# EAGLE design DAC and Digipot Breakout Board (EAGLE 9.6.2)
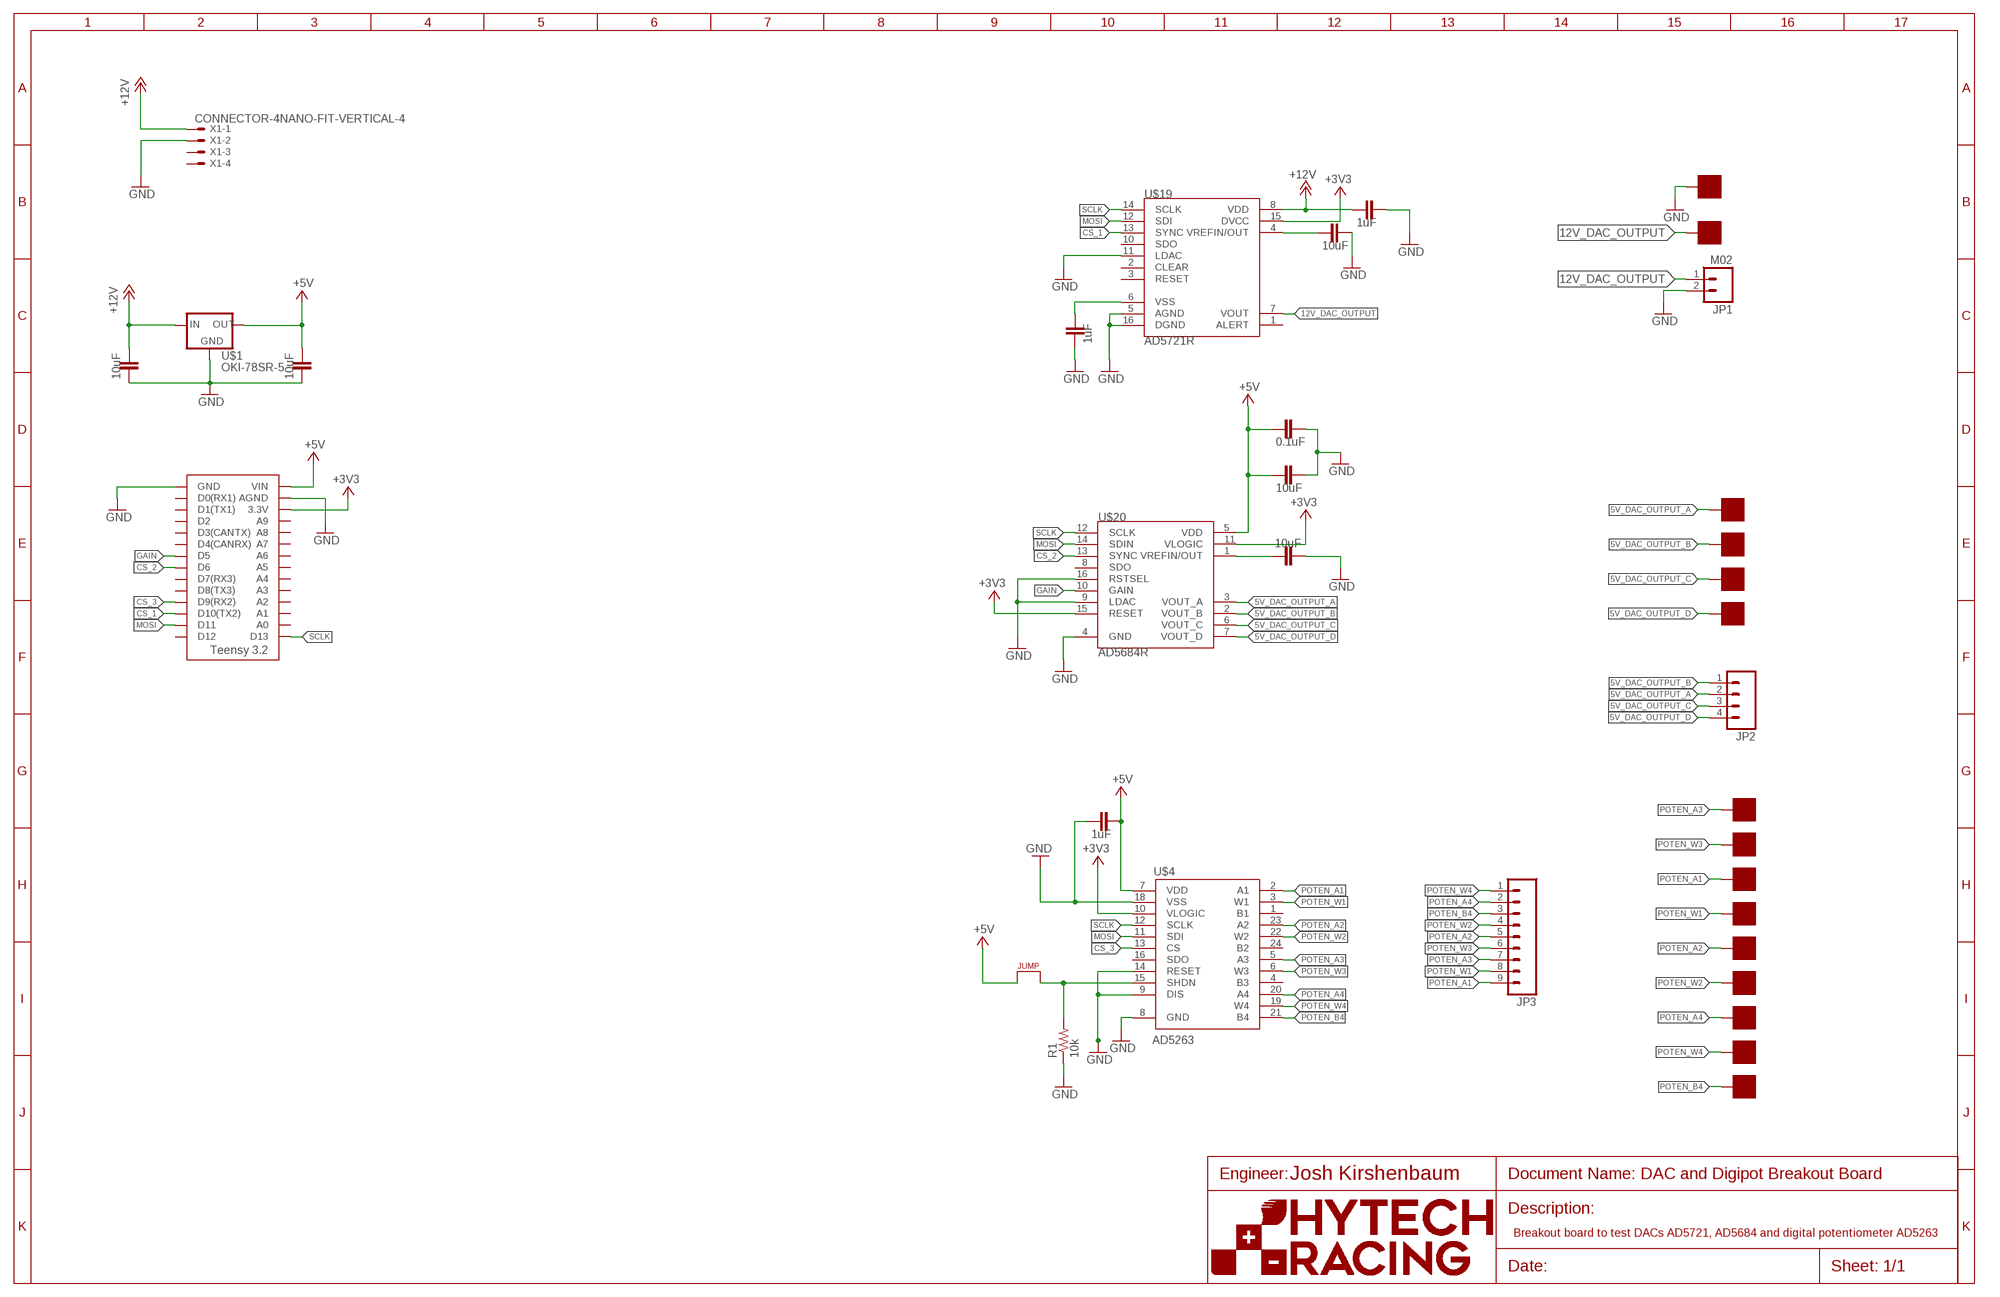
[diagram p0: schematic, sheet 1]
U$3 (FRAME_B): FRAME_DESCRIPTION: Default; ORIENTATION: LANDSCAPE; SIZE: B

## Parts
C1  1uF  CAP0603-CAP  [0603-CAP]
C2  1uF  CAP0603-CAP  [0603-CAP]
C3  10uF  CAP0603-CAP  [0603-CAP]
C4  0.1uF  CAP0603-CAP  [0603-CAP]
C5  1uF  CAP0603-CAP  [0603-CAP]
C6  10uF  CAP0603-CAP  [0603-CAP]
C7  10uF  CAP0603-CAP  [0603-CAP]
C8  10uF  CAP0603-CAP  [0603-CAP]
C9  10uF  CAP0603-CAP  [0603-CAP]
J1  JUMPER.1  [1X02]
JP1  M02  [1X02]
JP2  M04  [1X04]
JP3  M09  [1X09]
R1  10k  RESISTOR0603  [0603-RES]
U$1  OKI-78SR-5  [OKI-78SR]
U$2  TEENSY_3.2_SIMPLE  [TEENSY_3.2_SIMPLE]
U$4  AD5263  [TSSOP-24]
U$5  SOLDER_PAD  [SOLDER_PAD_XSMALL]
U$6  SOLDER_PAD  [SOLDER_PAD_XSMALL]
U$7  SOLDER_PAD  [SOLDER_PAD_XSMALL]
U$8  SOLDER_PAD  [SOLDER_PAD_XSMALL]
U$9  SOLDER_PAD  [SOLDER_PAD_XSMALL]
U$10  SOLDER_PAD  [SOLDER_PAD_XSMALL]
U$11  SOLDER_PAD  [SOLDER_PAD_XSMALL]
U$12  SOLDER_PAD  [SOLDER_PAD_XSMALL]
U$13  SOLDER_PAD  [SOLDER_PAD_XSMALL]
U$14  SOLDER_PAD  [SOLDER_PAD_XSMALL]
U$15  SOLDER_PAD  [SOLDER_PAD_XSMALL]
U$16  SOLDER_PAD  [SOLDER_PAD_XSMALL]
U$17  SOLDER_PAD  [SOLDER_PAD_XSMALL]
U$18  SOLDER_PAD  [SOLDER_PAD_XSMALL]
U$19  AD5721R  [TSSOP-16]
U$20  AD5684R  [TSSOP-16]
U$21  SOLDER_PAD  [SOLDER_PAD_XSMALL]
X1  CONNECTOR-4NANO-FIT-VERTICAL-4  [NANO-FIT_VERTICAL-4]

## Nets
5V_DAC_OUTPUT_A: JP2.2 U$6.P$1 U$20.3(VOUT_A)
5V_DAC_OUTPUT_B: JP2.1 U$7.P$1 U$20.2(VOUT_B)
5V_DAC_OUTPUT_C: JP2.3 U$8.P$1 U$20.6(VOUT_C)
5V_DAC_OUTPUT_D: JP2.4 U$9.P$1 U$20.7(VOUT_D)
12V_DAC_OUTPUT: JP1.1 U$5.P$1 U$19.7(VOUT)
+3V3: U$2.3.3V U$4.10(VLOGIC) U$19.15(DVCC) U$20.11(VLOGIC) U$20.15(RESET)
+5V: C3.2 C4.2 C5.1 C9.2 J1.1 U$1.3(OUT) U$2.VIN U$4.7(VDD) U$20.5(VDD)
+12V: C2.2 C8.2 U$1.1(IN) U$19.8(VDD) X1.P$1
CS_1: U$2.D10(TX2) U$19.13(SYNC)
CS_2: U$2.D6 U$20.13(SYNC)
CS_3: U$2.D9(RX2) U$4.13(CS)
GAIN: U$2.D5 U$20.10(GAIN)
GND: C1.2 C2.1 C3.1 C4.1 C5.2 C6.1 C7.2 C8.1 C9.1 JP1.2 R1.1 U$1.2(GND) U$2.GND U$4.8(GND) U$4.9(DIS) U$4.14(RESET) U$4.18(VSS) U$19.5(AGND) U$19.11(LDAC) U$19.16(DGND) U$20.4(GND) U$20.9(LDAC) U$20.16(RSTSEL) U$21.P$1 X1.P$2
MOSI: U$2.D11 U$4.11(SDI) U$19.12(SDI) U$20.14(SDIN)
N$1: U$2.AGND ; supply symbol labelled GND
N$2: J1.2 R1.2 U$4.15(SHDN)
N$3: C6.2 U$19.4(VREFIN/OUT)
N$4: C7.1 U$20.1(VREFIN/OUT)
POTEN_A1: JP3.9 U$4.2(A1) U$10.P$1
POTEN_A2: JP3.5 U$4.23(A2) U$12.P$1
POTEN_A3: JP3.7 U$4.5(A3) U$14.P$1
POTEN_A4: JP3.2 U$4.20(A4) U$16.P$1
POTEN_B4: JP3.3 U$4.21(B4) U$18.P$1
POTEN_W1: JP3.8 U$4.3(W1) U$11.P$1
POTEN_W2: JP3.4 U$4.22(W2) U$13.P$1
POTEN_W3: JP3.6 U$4.6(W3) U$15.P$1
POTEN_W4: JP3.1 U$4.19(W4) U$17.P$1
SCLK: U$2.D13 U$4.12(SCLK) U$19.14(SCLK) U$20.12(SCLK)
VSS: C1.1 U$19.6(VSS)
Unconnected: U$2.A0 U$2.A1 U$2.A2 U$2.A3 U$2.A4 U$2.A5 U$2.A6 U$2.A7 U$2.A8 U$2.A9 U$2.D0(RX1) U$2.D1(TX1) U$2.D2 U$2.D3(CANTX) U$2.D4(CANRX) U$2.D7(RX3) U$2.D8(TX3) U$2.D12 U$4.1(B1) U$4.4(B3) U$4.16(SDO) U$4.24(B2) U$19.1(ALERT) U$19.2(CLEAR) U$19.3(RESET) U$19.10(SDO) U$20.8(SDO) X1.P$3 X1.P$4

## Notes on the sheet
- Josh Kirshenbaum
- Breakout board to test DACs AD5721, AD5684 and digital potentiometer AD5263

## Library data of the parts
C1-C9 = HyTechDevices:CAP: Capacitor Standard 0603 ceramic capacitor, and 0.1" leaded capacitor.
J1 = HyTechDevices:JUMPER: Jumper for changing operation of a device
JP1 = HyTechDevices:M02: Standard 2-pin 0.1" header. NOTES ON THE VARIANTS LOCK and LOCK_LONGPADS... This footprint was designed to help hold the alignment of a through-hole component (i.e. 6-pin header) while soldering it into place. You may notice that each hole has been shifted either up or down by 0.005 of an inch from it's more standard position (which is a perfectly straight line). This slight alteration caused the pins (the squares in the middle) to touch the edges of the holes. Because they are alternating, it causes a "brace" to hold the component in place. 0.005 has proven to be the perfect amount of "off-center" position when using our standard breakaway headers. Although looks a little odd when you look at the bare footprint, once you have a header in there, the alteration is very hard to notice. Also,if you push a header all the way into place, it is covered up entirely on the bottom side. This idea of altering the position of holes to aid alignment will be further integrated into the Sparkfun Library for other footprints. It can help hold any component with 3 or more connection pins. Note: The Sparkfun version includes many other packages including surface mount that may be of future interest. Source: Sparkfun <https://github.com/sparkfun/SparkFun-Eagle-Libraries>
JP2 = HyTechDevices:M04: Standard 4-pin 0.1" header. NOTES ON THE VARIANTS LOCK and LOCK_LONGPADS... This footprint was designed to help hold the alignment of a through-hole component (i.e. 6-pin header) while soldering it into place. You may notice that each hole has been shifted either up or down by 0.005 of an inch from it's more standard position (which is a perfectly straight line). This slight alteration caused the pins (the squares in the middle) to touch the edges of the holes. Because they are alternating, it causes a "brace" to hold the component in place. 0.005 has proven to be the perfect amount of "off-center" position when using our standard breakaway headers. Although looks a little odd when you look at the bare footprint, once you have a header in there, the alteration is very hard to notice. Also,if you push a header all the way into place, it is covered up entirely on the bottom side. This idea of altering the position of holes to aid alignment will be further integrated into the Sparkfun Library for other footprints. It can help hold any component with 3 or more connection pins. Note: The Sparkfun version includes many other packages including surface mount that may be of future interest. Source: Sparkfun <https://github.com/sparkfun/SparkFun-Eagle-Libraries>
JP3 = HyTechDevices:M09: Standard 9-pin 0.1" header. Source: Sparkfun <https://github.com/sparkfun/SparkFun-Eagle-Libraries>
R1 = HyTechDevices:RESISTOR: Resistor Basic schematic elements and footprints for 0603, 1206, and PTH resistors.
U$1 = HyTechDevices:OKI-78SR-5: Murata OKI-78SR 5V 1.5A Non-Isolated Switching Regulator DC/DC - Datasheet <https://power.murata.com/data/power/oki-78sr.pdf>
U$2 = HyTechDevices:TEENSY_3.2_SIMPLE: Simple version of the Teensy 3.2 board that only uses the 2 main rows of pins, not the inner pins or the pins opposite the usb port.
U$4 = HyTechDevices:AD5263: AD5263 Digital Potentiometer Datasheet <https://www.analog.com/media/en/technical-documentation/data-sheets/AD5263.pdf>
U$5-U$18 U$21 = HyTechDevices:SOLDER_PAD: Solder pad used to attach wires directly to PCB
U$19 = HyTechDevices:AD5721R: AD5721 Digital to Analog Converter 12-bit resolution Datasheet <https://www.analog.com/media/en/technical-documentation/data-sheets/ad5761_5721.pdf>
U$20 = HyTechDevices:AD5684R: AD5684 4-channel DAC 5V, 12-bit resolution Datasheet <https://www.analog.com/media/en/technical-documentation/data-sheets/AD5686_5684.pdf>
X1 = HyTechDevices:CONNECTOR-4: Mini-Fit Junior connector 4 pole Source: http://www.molex.com

## Board
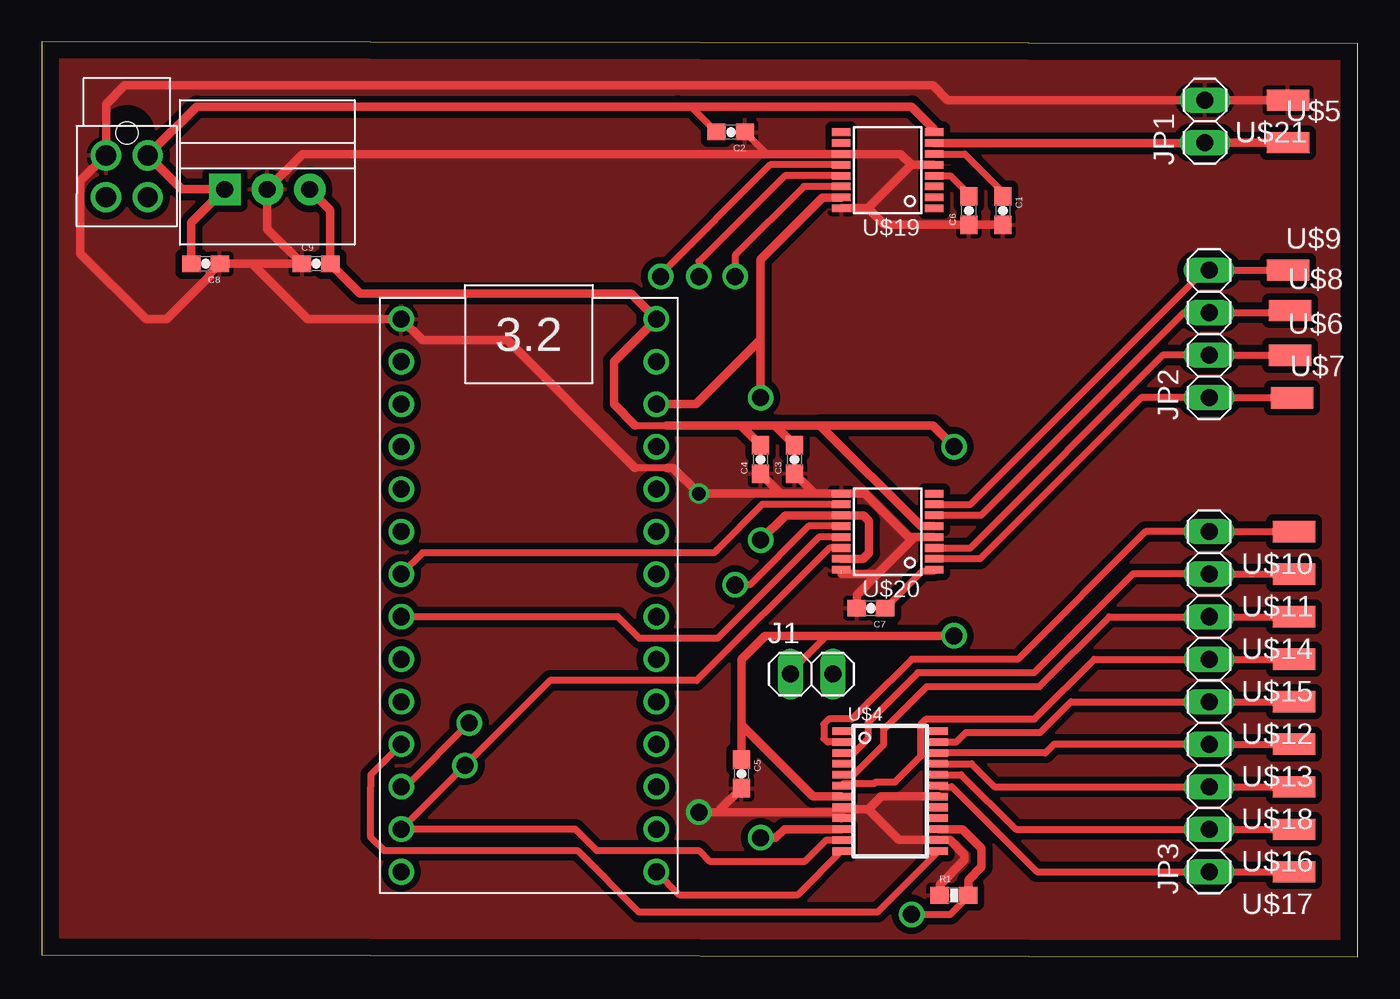
[diagram p1: board, top side]
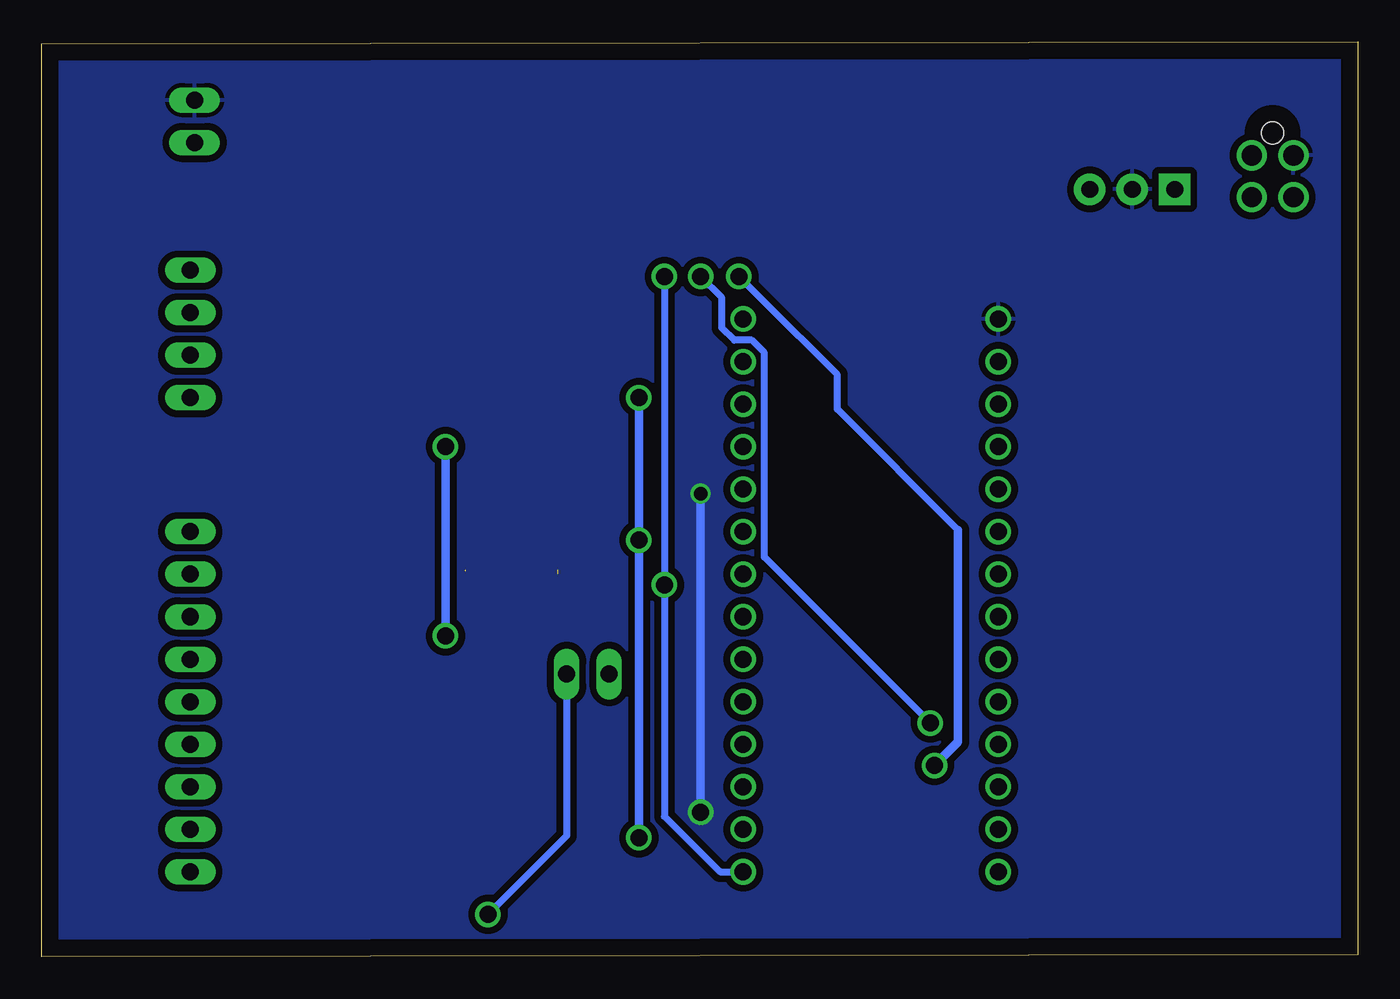
[diagram p2: board, bottom side, seen from below]

Size 78.59 x 54.66 mm. Coordinates in mm from the lower left corner, seen from the top.
Outline: 0,0.13 78.59,0 78.59,54.53 0,54.66 0,0.13
Copper layers (1*16): Top 0.035mm / dielectric 1.5mm / Bottom 0.035mm
Design rules "On Campus (2 Layer)": minimum track width 16mil, minimum drill 0.8mm, track to track 16mil, track to pad 12mil, pad to pad 16mil, via to via 16mil, smd to smd 10mil, copper to edge 40mil, drill to drill 10mil, minimum pad ring 10mil, minimum via ring 8mil, stop-mask expansion 4mil, vias tented up to drill 0mil, thermal gap 10mil

### Footprints (pad centres in the part's own frame; a part is rotated, then mirrored left to right if it is on the bottom)
0603-CAP = smd 1.1 x 1: 1 -0.85,0; 2 0.85,0
1X02 = drill 1.016 long: 1 -1.27,0; 2 1.27,0
1X04 = drill 1.016 long: 1 -3.81,0; 2 -1.27,0; 3 1.27,0; 4 3.81,0
1X09 = drill 1.016 long: 1 -8.89,0; 2 -6.35,0; 3 -3.81,0; 4 -1.27,0; 5 1.27,0; 6 3.81,0; 7 6.35,0; 8 8.89,0; 9 11.43,0
0603-RES = smd 1.1 x 1: 1 -0.85,0; 2 0.85,0
OKI-78SR = drill 1 pad 1.88 square: 1 -2.54,0 | drill 1 pad 1.88: 2 0,0; 3 2.54,0
TEENSY_3.2_SIMPLE = drill 1.016: 3.3V 16.51,29.21; A0 16.51,3.81; A1 16.51,6.35; A2 16.51,8.89; A3 16.51,11.43; A4 16.51,13.97; A5 16.51,16.51; A6 16.51,19.05; A7 16.51,21.59; A8 16.51,24.13; A9 16.51,26.67; AGND 16.51,31.75; D0(RX1) 1.27,31.75; D1(TX1) 1.27,29.21; D2 1.27,26.67; D3(CANTX) 1.27,24.13; D4(CANRX) 1.27,21.59; D5 1.27,19.05; D6 1.27,16.51; D7(RX3) 1.27,13.97; D8(TX3) 1.27,11.43; D9(RX2) 1.27,8.89; D10(TX2) 1.27,6.35; D11 1.27,3.81; D12 1.27,1.27; D13 16.51,1.27; GND 1.27,34.29; VIN 16.51,34.29
TSSOP-24 = smd 1.1 x 0.45: 1 -2.9,3.575; 2 -2.9,2.925; 3 -2.9,2.275; 4 -2.9,1.625; 5 -2.9,0.975; 6 -2.9,0.325; 7 -2.9,-0.325; 8 -2.9,-0.975; 9 -2.9,-1.625; 10 -2.9,-2.275; 11 -2.9,-2.925; 12 -2.9,-3.575; 13 2.9,-3.575; 14 2.9,-2.925; 15 2.9,-2.275; 16 2.9,-1.625; 17 2.9,-0.975; 18 2.9,-0.325; 19 2.9,0.325; 20 2.9,0.975; 21 2.9,1.625; 22 2.9,2.275; 23 2.9,2.925; 24 2.9,3.575
SOLDER_PAD_XSMALL = smd 2.54 x 1.27: P$1 0,0
TSSOP-16 = smd 0.45 x 1.1: 1 -2.275,-2.618; 2 -1.625,-2.618; 3 -0.975,-2.618; 4 -0.325,-2.618; 5 0.325,-2.618; 6 0.975,-2.618; 7 1.625,-2.618; 8 2.275,-2.618; 9 2.275,2.918; 10 1.625,2.918; 11 0.975,2.918; 12 0.325,2.918; 13 -0.325,2.918; 14 -0.975,2.918; 15 -1.625,2.918; 16 -2.275,2.918
NANO-FIT_VERTICAL-4 = drill 1.2: P$1 -1.25,0; P$2 1.25,0; P$3 -1.25,2.5; P$4 1.25,2.5 | hole 1.3: 0,-1.34

### Placement (x,y rotation side)
C1  57.4,44.58 270 top
C2  41.15,49.28 180 top
C3  44.96,29.72 90 top
C4  42.93,29.72 90 top
C5  41.78,10.92 270 top
C6  55.37,44.58 90 top
C7  49.53,20.83 180 top
C8  9.78,41.4 180 top
C9  16.38,41.4 0 top
J1  45.97,16.89 0 top
JP1  69.47,49.91 90 top
JP2  69.72,37.21 90 top
JP3  69.72,13.97 90 top
R1  54.48,3.68 0 top
U$1  13.46,45.85 0 top
U$2  20.19,3.81 0 top
U$4  50.67,9.91 0 top
U$5  74.42,48.64 180 top
U$6  74.55,35.94 180 top
U$7  74.68,33.4 180 top
U$8  74.55,38.61 180 top
U$9  74.42,41.02 180 top
U$10  74.8,25.4 0 top
U$11  74.8,22.86 0 top
U$12  74.8,15.24 0 top
U$13  74.8,12.7 0 top
U$14  74.8,20.32 0 top
U$15  74.8,17.78 0 top
U$16  74.8,7.62 0 top
U$17  74.8,5.08 0 top
U$18  74.8,10.16 0 top
U$19  50.67,46.99 90 top
U$20  50.67,25.4 90 top
U$21  74.42,51.18 0 top
X1  5.08,47.88 180 top

### Tracks (layer width: path | path; a pad name or v marks a point on that pad's centre or on a via)
5V_DAC_OUTPUT_A
  Top 0.406: U$20.3 55.45,24.43 66.97,35.94 JP2.2 U$6.P$1
5V_DAC_OUTPUT_B
  Top 0.406: U$20.2 56.03,23.77 65.66,33.4 JP2.1 U$7.P$1
5V_DAC_OUTPUT_C
  Top 0.406: U$20.6 56.09,26.38 68.2,38.48 JP2.3 74.42,38.48 U$8.P$1
5V_DAC_OUTPUT_D
  Top 0.406: U$20.7 55.47,27.02 69.47,41.02 JP2.4 U$9.P$1
12V_DAC_OUTPUT
  Top 0.508: U$19.7 69.44,48.62 JP1.1 U$5.P$1
+3V3  (via drill 1.02)
  Top 0.508: U$19.15 46.63,45.37 42.92,41.65 42.92,36.87 | 42.92,36.87 39.07,33.02 U$2.3.3V | U$20.15 49.05,23.77 49.4,24.13 49.4,26.04 49.06,26.38 U$20.11 44.41,26.38 v42.93,24.89 | 42.92,36.87 v42.92,33.41 v42.93,33.4 | U$4.10 44.34,7.63 43.83,7.11 v42.93,7.11
  Bottom 0.508: v42.93,33.4 v42.93,24.89 v42.93,7.11
+5V  (via drill 1.02)
  Top 0.406: J1.1 44.7,17.02 46.86,19.18 | 35.43,31.75 37.3,31.75
  Top 0.508: 43.78,31.75 41.78,31.75 41.78,31.71 | 43.78,31.75 46.48,31.75 | U$20.5 52.51,25.73 46.48,31.75 | C4.2 41.78,31.71 | C3.2 43.78,31.75 | U$1.3 17.23,44.62 C9.2 19.01,39.62 35.18,39.62 U$2.VIN 34.16,35.56 34.16,33.02 35.43,31.75 | v54.48,19.18 46.86,19.18 43.18,19.18 41.78,17.78 41.78,13.84 | U$4.7 46.05,9.58 41.78,13.84 | C5.1 41.78,13.84 | v54.48,30.48 53.21,31.75 46.48,31.75 | 41.78,31.71 41.74,31.75 37.3,31.75
  Bottom 0.508: v54.48,30.48 v54.48,19.18
+12V
  Top 0.406: C2.2 38.77,50.8 37.97,50.8
  Top 0.508: U$19.8 53.29,49.45 51.94,50.8 37.97,50.8 9.25,50.8 X1.P$1 8.36,45.85 U$1.1 8.93,43.85 C8.2
CS_1  (via drill 1.02)
  Top 0.406: v39.24,40.64 39.24,41.54 44.37,46.66 U$19.13 | U$2.D10(TX2) 21.72,10.16 v25.53,13.97
  Bottom 0.406: v25.53,13.97 35.43,23.88 35.43,36.09 36.18,36.83 37.23,36.83 37.97,37.57 37.97,39.37 v39.24,40.64
CS_2
  Top 0.406: U$20.13 46.41,25.07 40.37,19.03 35.69,19.03 34.41,20.32 U$2.D6
CS_3
  Top 0.406: U$4.13 49.91,2.67 35.67,2.67 31.99,6.35 20.44,6.35 19.65,7.14 19.65,10.16 19.65,10.64 19.65,10.88 U$2.D9(RX2)
GAIN
  Top 0.406: U$20.10 43.03,27.02 40.32,24.32 40.13,24.13 22.73,24.13 U$2.D5
GND  (via drill 0.8, 1.02)  (1 unrouted)
  Top 0.406: 43.31,47.96 C2.1 | 37.3,29.21 35.43,29.21
  Top 0.508: U$19.5 51.94,47.32 | 49.34,44.71 U$19.16 | 51.94,47.32 51.29,47.96 U$19.11 43.31,47.96 15.58,47.96 U$1.2 13.46,43.47 C9.1 12.57,41.4 | 51.94,47.32 49.34,44.71 | 49.34,44.71 50.33,43.73 C6.1 C1.2 | U$20.4 52.13,25.07 | 52.13,25.07 51.76,25.07 49.15,27.69 47.77,27.69 U$20.9 46.15,27.68 | C7.2 48.68,21.63 49.91,22.86 | 52.13,25.07 49.91,22.86 | 12.57,41.4 C8.1 10.04,40.81 10.04,40.67 7.47,38.1 6.22,38.1 2.31,42.02 2.31,46.35 X1.P$2 3.83,50.95 4.95,52.07 53.21,52.07 54.1,51.18 JP1.2 U$21.P$1 | U$4.8 47.77,8.8 49.37,8.8 | 49.37,8.8 51.19,6.98 U$4.14 54.23,6.98 55.12,6.1 55.12,5.8 53.63,4.32 R1.1 | U$4.18 50.15,9.58 49.37,8.8 | U$4.9 U$4.8 | U$4.8 47.48,8.64 40.51,8.64 | 40.51,8.64 v39.24,8.64 | C5.2 40.51,8.8 40.51,8.64 | 12.57,41.4 15.87,38.1 U$2.GND 22.73,36.83 27.81,36.83 35.43,29.21 | 46.15,27.68 C3.1 | 46.15,27.68 44.12,27.68 | 44.12,27.68 v39.24,27.68 37.71,29.21 37.3,29.21 | 44.12,27.68 C4.1 | 49.91,22.86 47.75,22.86
  Bottom 0.508: v39.24,27.68 v39.24,8.64
  pour Top: -0.13,54.61 78.61,54.61 78.61,0 -0.13,0
  pour Bottom: -0.13,54.61 -0.13,0 78.61,0 78.61,54.61
MOSI  (via drill 1.02)
  Top 0.406: v36.96,40.64 36.96,40.77 43.5,47.32 U$19.12 | U$20.14 47.03,24.43 39.12,16.51 30.35,16.51 v25.27,11.43 U$2.D11 31.87,7.62 33.14,6.35 39.24,6.35 39.88,5.72 45.59,5.72 46.86,6.98 U$4.11
  Bottom 0.406: v36.96,40.64 35.58,39.26 35.57,39.26 31.08,34.77 31.08,32.72 23.87,25.51
  Bottom 0.508: 23.87,25.51 23.87,12.84 v25.27,11.43
N$2  (via drill 1.02)
  Top 0.406: R1.2 55.36,3.64 54.26,2.54 v51.94,2.54
  Top 0.508: U$4.15 54.98,7.63 56.13,6.48 56.13,5.37 55.33,4.57 R1.2
  Bottom 0.406: J1.2 47.24,7.24 v51.94,2.54
N$3
  Top 0.406: U$19.4 54.26,46.66 55.37,45.55 C6.2
N$4  (1 unrouted)
  Top 0.406: C7.1 52.59,23.04 53.29,23.04
POTEN_A1
  Top 0.406: U$10.P$1 JP3.9 65.91,25.4 58.29,17.78 51.96,17.78 49.41,15.23 49.39,15.23 48.38,14.21 47.01,14.21 46.72,13.92 46.72,13.05 46.93,12.83 U$4.2
POTEN_A2
  Top 0.406: U$12.P$1 JP3.5 61.47,15.24 59.64,13.4 55.18,13.4 54.61,12.83 U$4.23
POTEN_A3
  Top 0.406: U$4.5 48.47,10.88 50.29,12.7 50.29,13.59 52.86,16.15 59.59,16.15 63.76,20.32 JP3.7 U$14.P$1
POTEN_A4
  Top 0.406: U$4.20 54.91,10.88 58.17,7.62 JP3.2 U$16.P$1
POTEN_B4
  Top 0.406: U$4.21 55.52,11.53 56.9,10.16 JP3.3 U$18.P$1
POTEN_W1
  Top 0.406: U$4.3 48.5,12.18 49.36,13.04 49.36,14.01 52.32,16.97 59.26,16.97 65.15,22.86 JP3.8 U$11.P$1
POTEN_W2
  Top 0.406: U$4.22 59.93,12.18 60.45,12.7 JP3.4 U$13.P$1
POTEN_W3
  Top 0.406: U$4.6 47.9,10.36 49.71,10.36 49.8,10.45 50.96,10.45 52.52,12 52.52,13.92 52.81,14.21 59.3,14.21 62.86,17.78 JP3.6 U$15.P$1
POTEN_W4
  Top 0.406: U$4.19 53.64,10.16 54.36,10.16 59.44,5.08 JP3.1 U$17.P$1
SCLK  (via drill 1.02)
  Top 0.406: U$19.14 45.51,46.02 41.4,41.91 v41.4,40.64 | U$20.12 45.79,25.73 42.29,22.23 v41.4,22.23 | U$4.12 45.12,3.68 38.1,3.68 U$2.D13
  Bottom 0.406: v41.4,40.64 v41.4,22.23 41.4,8.38 38.1,5.08 U$2.D13
VSS
  Top 0.406: U$19.6 55.12,47.96 57.4,45.68 C1.1